# Altium schematic sheet Main.SchDoc
size A3; PageSetup: Record=PageOptions|CenterHorizontal=True|CenterVertical=True|PrintScale=0.73|XCorrection=1.00|YCorrection=1.00|PrintKind=0|BorderSize=5000000|LeftOffset=0|BottomOffset=0|Orientation=2|PaperLength=1000|PaperWidth=1000|Scale=100|PaperSource=7|PrintQuality=600|MediaType=1|DitherType=10|PaperKind=A4|PrintScaleMode=1
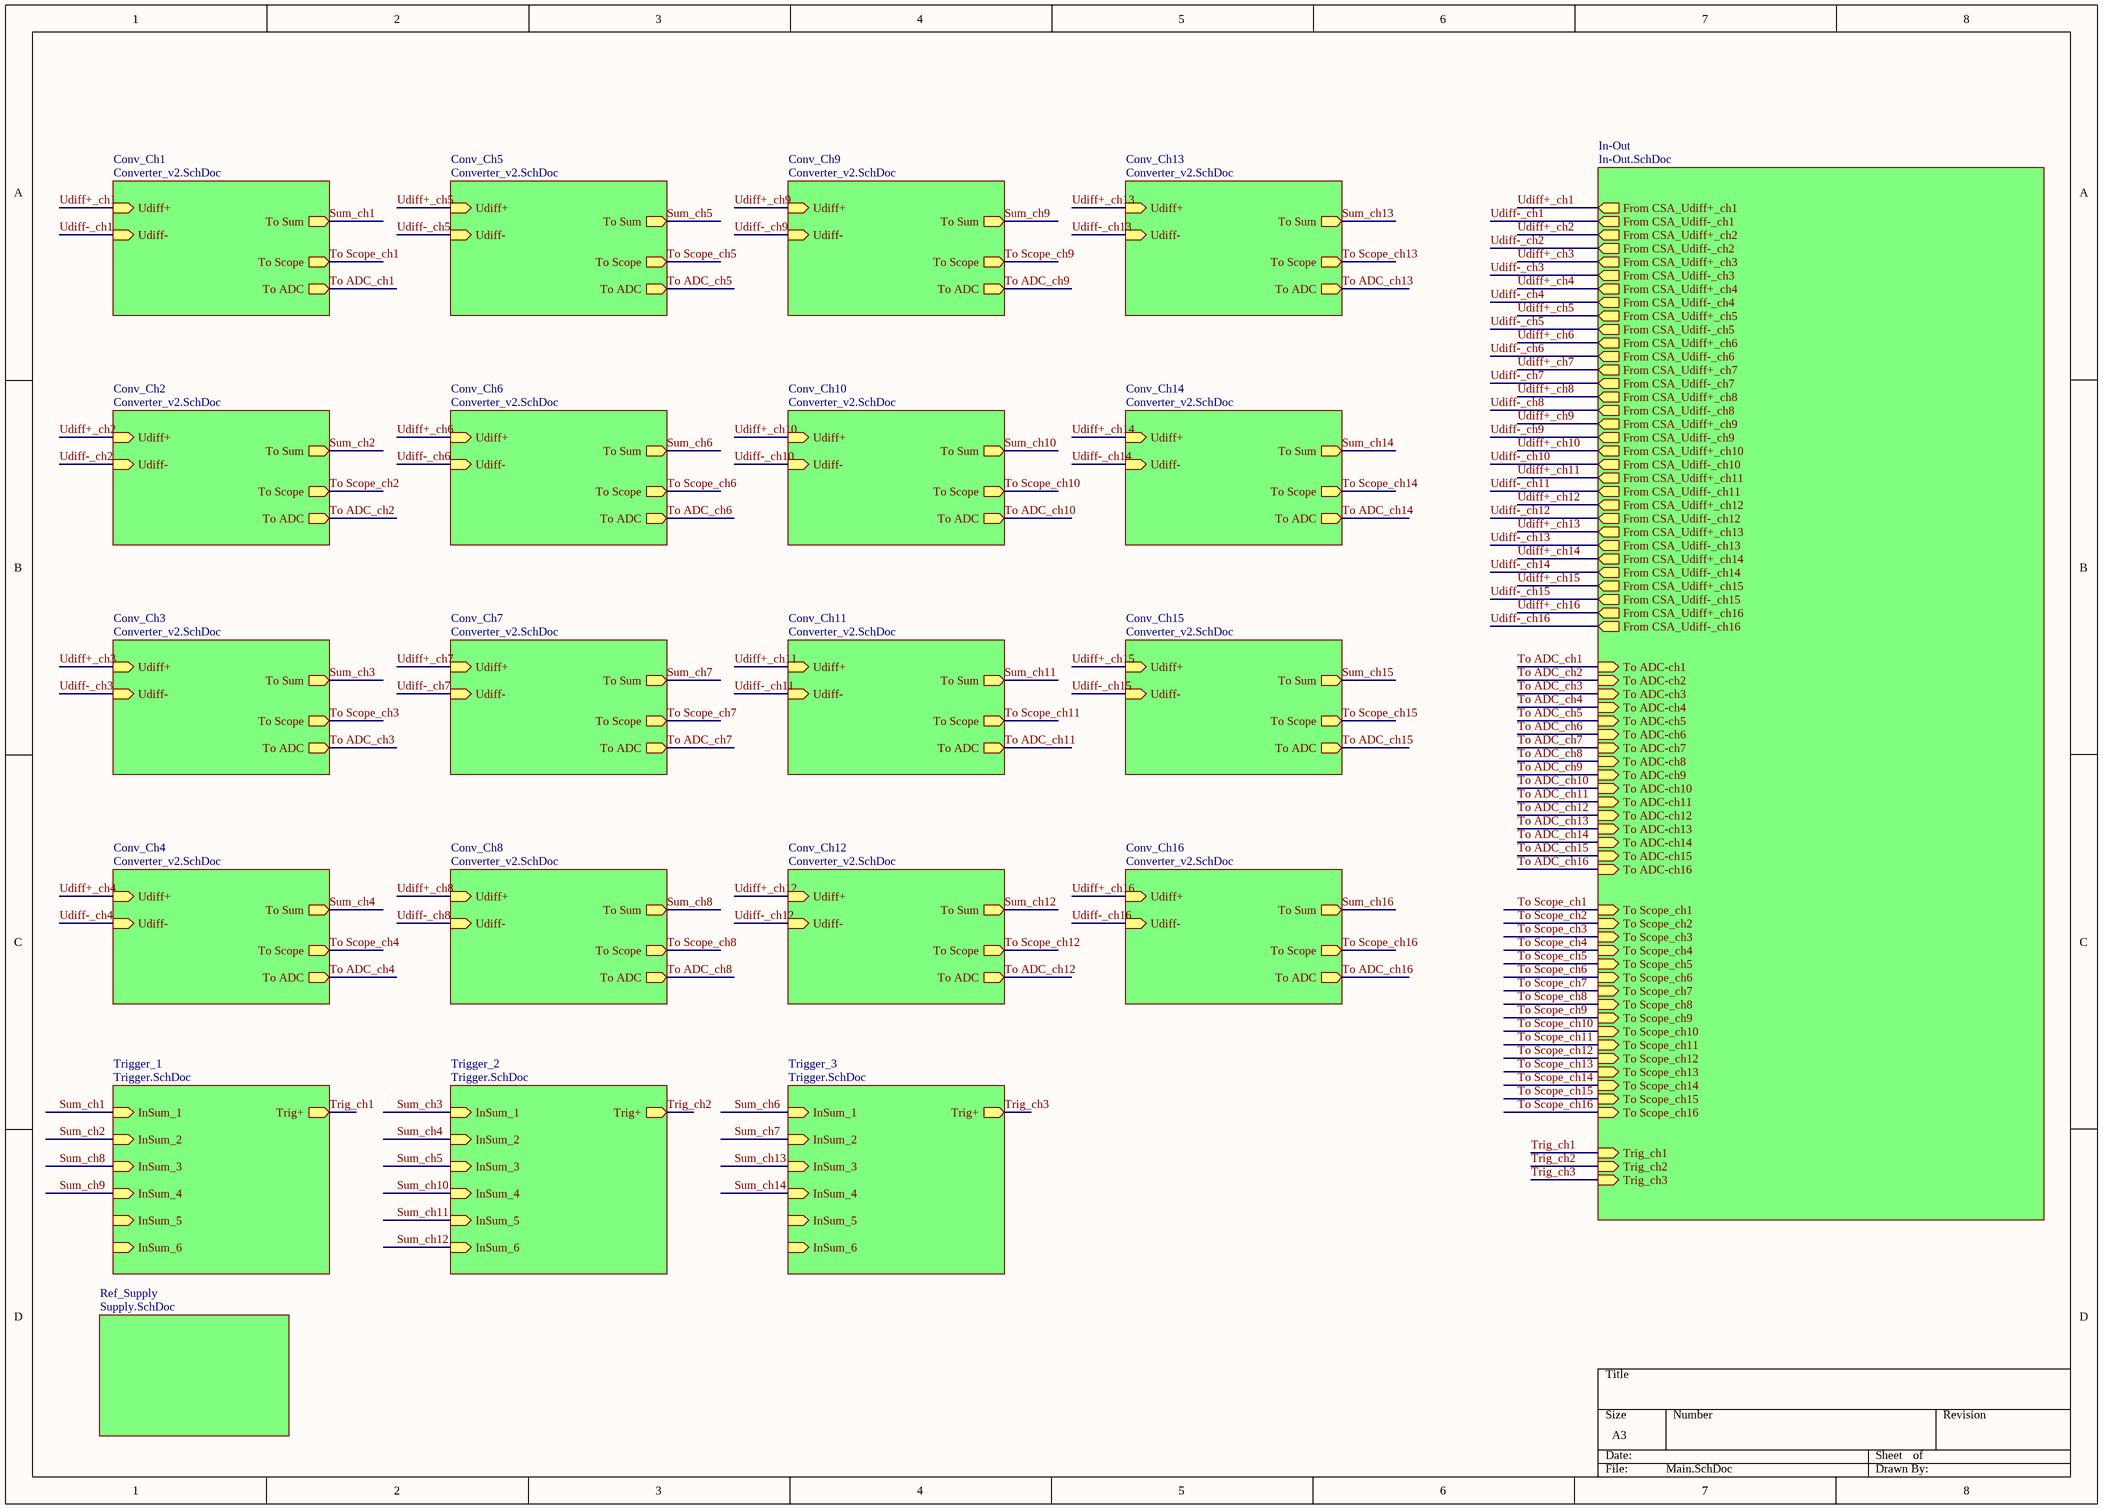
[diagram p0: Main.SchDoc]

## Sub-sheets
Conv_Ch1 = Converter_v2.SchDoc: Udiff+ (in), Udiff- (in), To ADC (out), To Sum (out), To Scope (out)
Conv_Ch2 = Converter_v2.SchDoc: Udiff+ (in), Udiff- (in), To ADC (out), To Sum (out), To Scope (out)
Conv_Ch3 = Converter_v2.SchDoc: Udiff+ (in), Udiff- (in), To ADC (out), To Sum (out), To Scope (out)
Conv_Ch4 = Converter_v2.SchDoc: Udiff+ (in), Udiff- (in), To ADC (out), To Sum (out), To Scope (out)
Conv_Ch5 = Converter_v2.SchDoc: Udiff+ (in), Udiff- (in), To ADC (out), To Sum (out), To Scope (out)
Conv_Ch6 = Converter_v2.SchDoc: Udiff+ (in), Udiff- (in), To ADC (out), To Sum (out), To Scope (out)
Conv_Ch7 = Converter_v2.SchDoc: Udiff+ (in), Udiff- (in), To ADC (out), To Sum (out), To Scope (out)
Conv_Ch8 = Converter_v2.SchDoc: Udiff+ (in), Udiff- (in), To ADC (out), To Sum (out), To Scope (out)
Conv_Ch9 = Converter_v2.SchDoc: Udiff+ (in), Udiff- (in), To ADC (out), To Sum (out), To Scope (out)
Conv_Ch10 = Converter_v2.SchDoc: Udiff+ (in), Udiff- (in), To ADC (out), To Sum (out), To Scope (out)
Conv_Ch11 = Converter_v2.SchDoc: Udiff+ (in), Udiff- (in), To ADC (out), To Sum (out), To Scope (out)
Conv_Ch12 = Converter_v2.SchDoc: Udiff+ (in), Udiff- (in), To ADC (out), To Sum (out), To Scope (out)
Conv_Ch13 = Converter_v2.SchDoc: Udiff+ (in), Udiff- (in), To ADC (out), To Sum (out), To Scope (out)
Conv_Ch14 = Converter_v2.SchDoc: Udiff+ (in), Udiff- (in), To ADC (out), To Sum (out), To Scope (out)
Conv_Ch15 = Converter_v2.SchDoc: Udiff+ (in), Udiff- (in), To ADC (out), To Sum (out), To Scope (out)
Conv_Ch16 = Converter_v2.SchDoc: Udiff+ (in), Udiff- (in), To ADC (out), To Sum (out), To Scope (out)
In-Out = In-Out.SchDoc: To ADC-ch1 (in), To ADC-ch2 (in), To ADC-ch3 (in), To ADC-ch4 (in), To ADC-ch5 (in), To ADC-ch6 (in), To ADC-ch7 (in), To ADC-ch8 (in), To ADC-ch9 (in), To ADC-ch10 (in), To ADC-ch11 (in), To ADC-ch12 (in), To ADC-ch13 (in), To ADC-ch14 (in), From CSA_Udiff+_ch1 (out), From CSA_Udiff+_ch2 (out), From CSA_Udiff+_ch3 (out), From CSA_Udiff+_ch4 (out), From CSA_Udiff+_ch5 (out), From CSA_Udiff+_ch6 (out), From CSA_Udiff+_ch7 (out), From CSA_Udiff+_ch8 (out), From CSA_Udiff+_ch9 (out), From CSA_Udiff+_ch10 (out), From CSA_Udiff+_ch11 (out), From CSA_Udiff+_ch12 (out), From CSA_Udiff+_ch13 (out), From CSA_Udiff+_ch14 (out), From CSA_Udiff-_ch1 (out), From CSA_Udiff-_ch2 (out), From CSA_Udiff-_ch3 (out), From CSA_Udiff-_ch4 (out), From CSA_Udiff-_ch5 (out), From CSA_Udiff-_ch6 (out), From CSA_Udiff-_ch7 (out), From CSA_Udiff-_ch8 (out), From CSA_Udiff-_ch9 (out), From CSA_Udiff-_ch10 (out), From CSA_Udiff-_ch11 (out), From CSA_Udiff-_ch12 (out), From CSA_Udiff-_ch13 (out), From CSA_Udiff-_ch14 (out), To ADC-ch15 (in), To ADC-ch16 (in), From CSA_Udiff+_ch15 (out), From CSA_Udiff+_ch16 (out), From CSA_Udiff-_ch15 (out), From CSA_Udiff-_ch16 (out), Trig_ch1 (in), Trig_ch2 (in), Trig_ch3 (in), To Scope_ch1 (in), To Scope_ch2 (in), To Scope_ch3 (in), To Scope_ch4 (in), To Scope_ch5 (in), To Scope_ch6 (in), To Scope_ch7 (in), To Scope_ch8 (in), To Scope_ch9 (in), To Scope_ch10 (in), To Scope_ch11 (in), To Scope_ch12 (in), To Scope_ch13 (in), To Scope_ch14 (in), To Scope_ch15 (in), To Scope_ch16 (in)
Ref_Supply = Supply.SchDoc: no entries
Trigger_1 = Trigger.SchDoc: InSum_1 (in), InSum_2 (in), InSum_3 (in), InSum_4 (in), Trig+ (out), InSum_5 (in), InSum_6 (in)
Trigger_2 = Trigger.SchDoc: InSum_1 (in), InSum_2 (in), InSum_3 (in), InSum_4 (in), Trig+ (out), InSum_5 (in), InSum_6 (in)
Trigger_3 = Trigger.SchDoc: InSum_1 (in), InSum_2 (in), InSum_3 (in), InSum_4 (in), Trig+ (out), InSum_5 (in), InSum_6 (in)

## Nets
Sum_ch1: sheet Conv_Ch1/To Sum, sheet Trigger_1/InSum_1
Sum_ch2: sheet Conv_Ch2/To Sum, sheet Trigger_1/InSum_2
Sum_ch3: sheet Conv_Ch3/To Sum, sheet Trigger_2/InSum_1
Sum_ch4: sheet Conv_Ch4/To Sum, sheet Trigger_2/InSum_2
Sum_ch5: sheet Conv_Ch5/To Sum, sheet Trigger_2/InSum_3
Sum_ch6: sheet Conv_Ch6/To Sum, sheet Trigger_3/InSum_1
Sum_ch7: sheet Conv_Ch7/To Sum, sheet Trigger_3/InSum_2
Sum_ch8: sheet Conv_Ch8/To Sum, sheet Trigger_1/InSum_3
Sum_ch9: sheet Conv_Ch9/To Sum, sheet Trigger_1/InSum_4
Sum_ch10: sheet Conv_Ch10/To Sum, sheet Trigger_2/InSum_4
Sum_ch11: sheet Conv_Ch11/To Sum, sheet Trigger_2/InSum_5
Sum_ch12: sheet Conv_Ch12/To Sum, sheet Trigger_2/InSum_6
Sum_ch13: sheet Conv_Ch13/To Sum, sheet Trigger_3/InSum_3
Sum_ch14: sheet Conv_Ch14/To Sum, sheet Trigger_3/InSum_4
Sum_ch15: sheet Conv_Ch15/To Sum
Sum_ch16: sheet Conv_Ch16/To Sum
To ADC_ch1: sheet Conv_Ch1/To ADC, sheet In-Out/To ADC-ch1
To ADC_ch2: sheet Conv_Ch2/To ADC, sheet In-Out/To ADC-ch2
To ADC_ch3: sheet Conv_Ch3/To ADC, sheet In-Out/To ADC-ch3
To ADC_ch4: sheet Conv_Ch4/To ADC, sheet In-Out/To ADC-ch4
To ADC_ch5: sheet Conv_Ch5/To ADC, sheet In-Out/To ADC-ch5
To ADC_ch6: sheet Conv_Ch6/To ADC, sheet In-Out/To ADC-ch6
To ADC_ch7: sheet Conv_Ch7/To ADC, sheet In-Out/To ADC-ch7
To ADC_ch8: sheet Conv_Ch8/To ADC, sheet In-Out/To ADC-ch8
To ADC_ch9: sheet Conv_Ch9/To ADC, sheet In-Out/To ADC-ch9
To ADC_ch10: sheet Conv_Ch10/To ADC, sheet In-Out/To ADC-ch10
To ADC_ch11: sheet Conv_Ch11/To ADC, sheet In-Out/To ADC-ch11
To ADC_ch12: sheet Conv_Ch12/To ADC, sheet In-Out/To ADC-ch12
To ADC_ch13: sheet Conv_Ch13/To ADC, sheet In-Out/To ADC-ch13
To ADC_ch14: sheet Conv_Ch14/To ADC, sheet In-Out/To ADC-ch14
To ADC_ch15: sheet Conv_Ch15/To ADC, sheet In-Out/To ADC-ch15
To ADC_ch16: sheet Conv_Ch16/To ADC, sheet In-Out/To ADC-ch16
To Scope_ch1: sheet Conv_Ch1/To Scope, sheet In-Out/To Scope_ch1
To Scope_ch2: sheet Conv_Ch2/To Scope, sheet In-Out/To Scope_ch2
To Scope_ch3: sheet Conv_Ch3/To Scope, sheet In-Out/To Scope_ch3
To Scope_ch4: sheet Conv_Ch4/To Scope, sheet In-Out/To Scope_ch4
To Scope_ch5: sheet Conv_Ch5/To Scope, sheet In-Out/To Scope_ch5
To Scope_ch6: sheet Conv_Ch6/To Scope, sheet In-Out/To Scope_ch6
To Scope_ch7: sheet Conv_Ch7/To Scope, sheet In-Out/To Scope_ch7
To Scope_ch8: sheet Conv_Ch8/To Scope, sheet In-Out/To Scope_ch8
To Scope_ch9: sheet Conv_Ch9/To Scope, sheet In-Out/To Scope_ch9
To Scope_ch10: sheet Conv_Ch10/To Scope, sheet In-Out/To Scope_ch10
To Scope_ch11: sheet Conv_Ch11/To Scope, sheet In-Out/To Scope_ch11
To Scope_ch12: sheet Conv_Ch12/To Scope, sheet In-Out/To Scope_ch12
To Scope_ch13: sheet Conv_Ch13/To Scope, sheet In-Out/To Scope_ch13
To Scope_ch14: sheet Conv_Ch14/To Scope, sheet In-Out/To Scope_ch14
To Scope_ch15: sheet Conv_Ch15/To Scope, sheet In-Out/To Scope_ch15
To Scope_ch16: sheet Conv_Ch16/To Scope, sheet In-Out/To Scope_ch16
Trig_ch1: sheet In-Out/Trig_ch1, sheet Trigger_1/Trig+
Trig_ch2: sheet In-Out/Trig_ch2, sheet Trigger_2/Trig+
Trig_ch3: sheet In-Out/Trig_ch3, sheet Trigger_3/Trig+
Udiff+_ch1: sheet Conv_Ch1/Udiff+, sheet In-Out/From CSA_Udiff+_ch1
Udiff+_ch2: sheet Conv_Ch2/Udiff+, sheet In-Out/From CSA_Udiff+_ch2
Udiff+_ch3: sheet Conv_Ch3/Udiff+, sheet In-Out/From CSA_Udiff+_ch3
Udiff+_ch4: sheet Conv_Ch4/Udiff+, sheet In-Out/From CSA_Udiff+_ch4
Udiff+_ch5: sheet Conv_Ch5/Udiff+, sheet In-Out/From CSA_Udiff+_ch5
Udiff+_ch6: sheet Conv_Ch6/Udiff+, sheet In-Out/From CSA_Udiff+_ch6
Udiff+_ch7: sheet Conv_Ch7/Udiff+, sheet In-Out/From CSA_Udiff+_ch7
Udiff+_ch8: sheet Conv_Ch8/Udiff+, sheet In-Out/From CSA_Udiff+_ch8
Udiff+_ch9: sheet Conv_Ch9/Udiff+, sheet In-Out/From CSA_Udiff+_ch9
Udiff+_ch10: sheet Conv_Ch10/Udiff+, sheet In-Out/From CSA_Udiff+_ch10
Udiff+_ch11: sheet Conv_Ch11/Udiff+, sheet In-Out/From CSA_Udiff+_ch11
Udiff+_ch12: sheet Conv_Ch12/Udiff+, sheet In-Out/From CSA_Udiff+_ch12
Udiff+_ch13: sheet Conv_Ch13/Udiff+, sheet In-Out/From CSA_Udiff+_ch13
Udiff+_ch14: sheet Conv_Ch14/Udiff+, sheet In-Out/From CSA_Udiff+_ch14
Udiff+_ch15: sheet Conv_Ch15/Udiff+, sheet In-Out/From CSA_Udiff+_ch15
Udiff+_ch16: sheet Conv_Ch16/Udiff+, sheet In-Out/From CSA_Udiff+_ch16
Udiff-_ch1: sheet Conv_Ch1/Udiff-, sheet In-Out/From CSA_Udiff-_ch1
Udiff-_ch2: sheet Conv_Ch2/Udiff-, sheet In-Out/From CSA_Udiff-_ch2
Udiff-_ch3: sheet Conv_Ch3/Udiff-, sheet In-Out/From CSA_Udiff-_ch3
Udiff-_ch4: sheet Conv_Ch4/Udiff-, sheet In-Out/From CSA_Udiff-_ch4
Udiff-_ch5: sheet Conv_Ch5/Udiff-, sheet In-Out/From CSA_Udiff-_ch5
Udiff-_ch6: sheet Conv_Ch6/Udiff-, sheet In-Out/From CSA_Udiff-_ch6
Udiff-_ch7: sheet Conv_Ch7/Udiff-, sheet In-Out/From CSA_Udiff-_ch7
Udiff-_ch8: sheet Conv_Ch8/Udiff-, sheet In-Out/From CSA_Udiff-_ch8
Udiff-_ch9: sheet Conv_Ch9/Udiff-, sheet In-Out/From CSA_Udiff-_ch9
Udiff-_ch10: sheet Conv_Ch10/Udiff-, sheet In-Out/From CSA_Udiff-_ch10
Udiff-_ch11: sheet Conv_Ch11/Udiff-, sheet In-Out/From CSA_Udiff-_ch11
Udiff-_ch12: sheet Conv_Ch12/Udiff-, sheet In-Out/From CSA_Udiff-_ch12
Udiff-_ch13: sheet Conv_Ch13/Udiff-, sheet In-Out/From CSA_Udiff-_ch13
Udiff-_ch14: sheet Conv_Ch14/Udiff-, sheet In-Out/From CSA_Udiff-_ch14
Udiff-_ch15: sheet Conv_Ch15/Udiff-, sheet In-Out/From CSA_Udiff-_ch15
Udiff-_ch16: sheet Conv_Ch16/Udiff-, sheet In-Out/From CSA_Udiff-_ch16